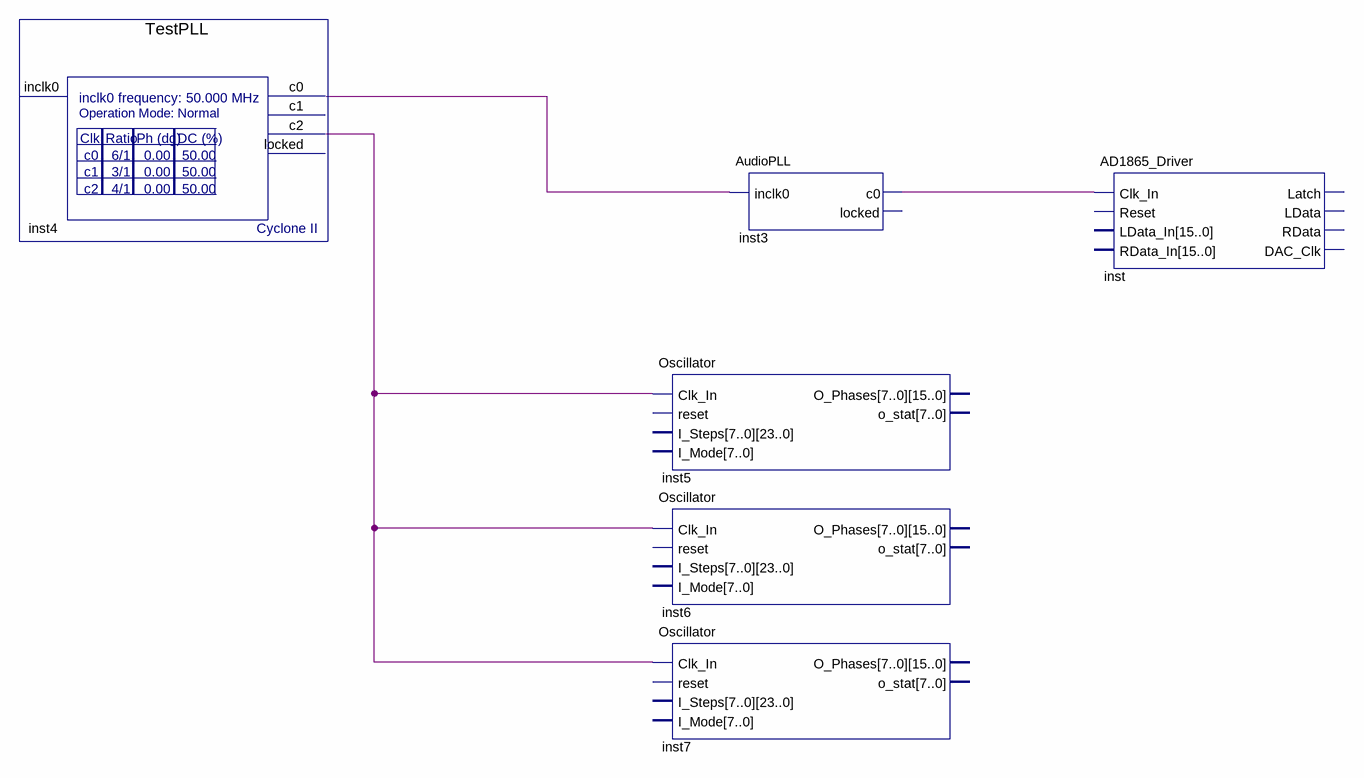
[diagram p0: schematic sheet]
// Quartus schematic PolySynth_top.bdf as structural Verilog: 6 symbols, 0 pins
module PolySynth_top (
);

  wire inst3_c0, inst4_c0, inst4_c2;

  TestPLL inst4 (.c0(inst4_c0), .c2(inst4_c2));  // open: inclk0, c1, locked
  Oscillator inst5 (.Clk_In(inst4_c2));  // open: reset, I_Steps, I_Mode, O_Phases, o_stat
  Oscillator inst6 (.Clk_In(inst4_c2));  // open: reset, I_Steps, I_Mode, O_Phases, o_stat
  Oscillator inst7 (.Clk_In(inst4_c2));  // open: reset, I_Steps, I_Mode, O_Phases, o_stat
  AudioPLL inst3 (.inclk0(inst4_c0), .c0(inst3_c0));  // open: locked
  AD1865_Driver inst (.Clk_In(inst3_c0));  // open: Reset, LData_In, RData_In, Latch, LData, RData, DAC_Clk
endmodule
